# EasyEDA schematic G1000_Pan_Range.json
TITLE: Sheet_1; REV: 1.0; Date: 2024-03-31; Sheet: 1/1; Drawn By: gagagu1; Company: Your Company
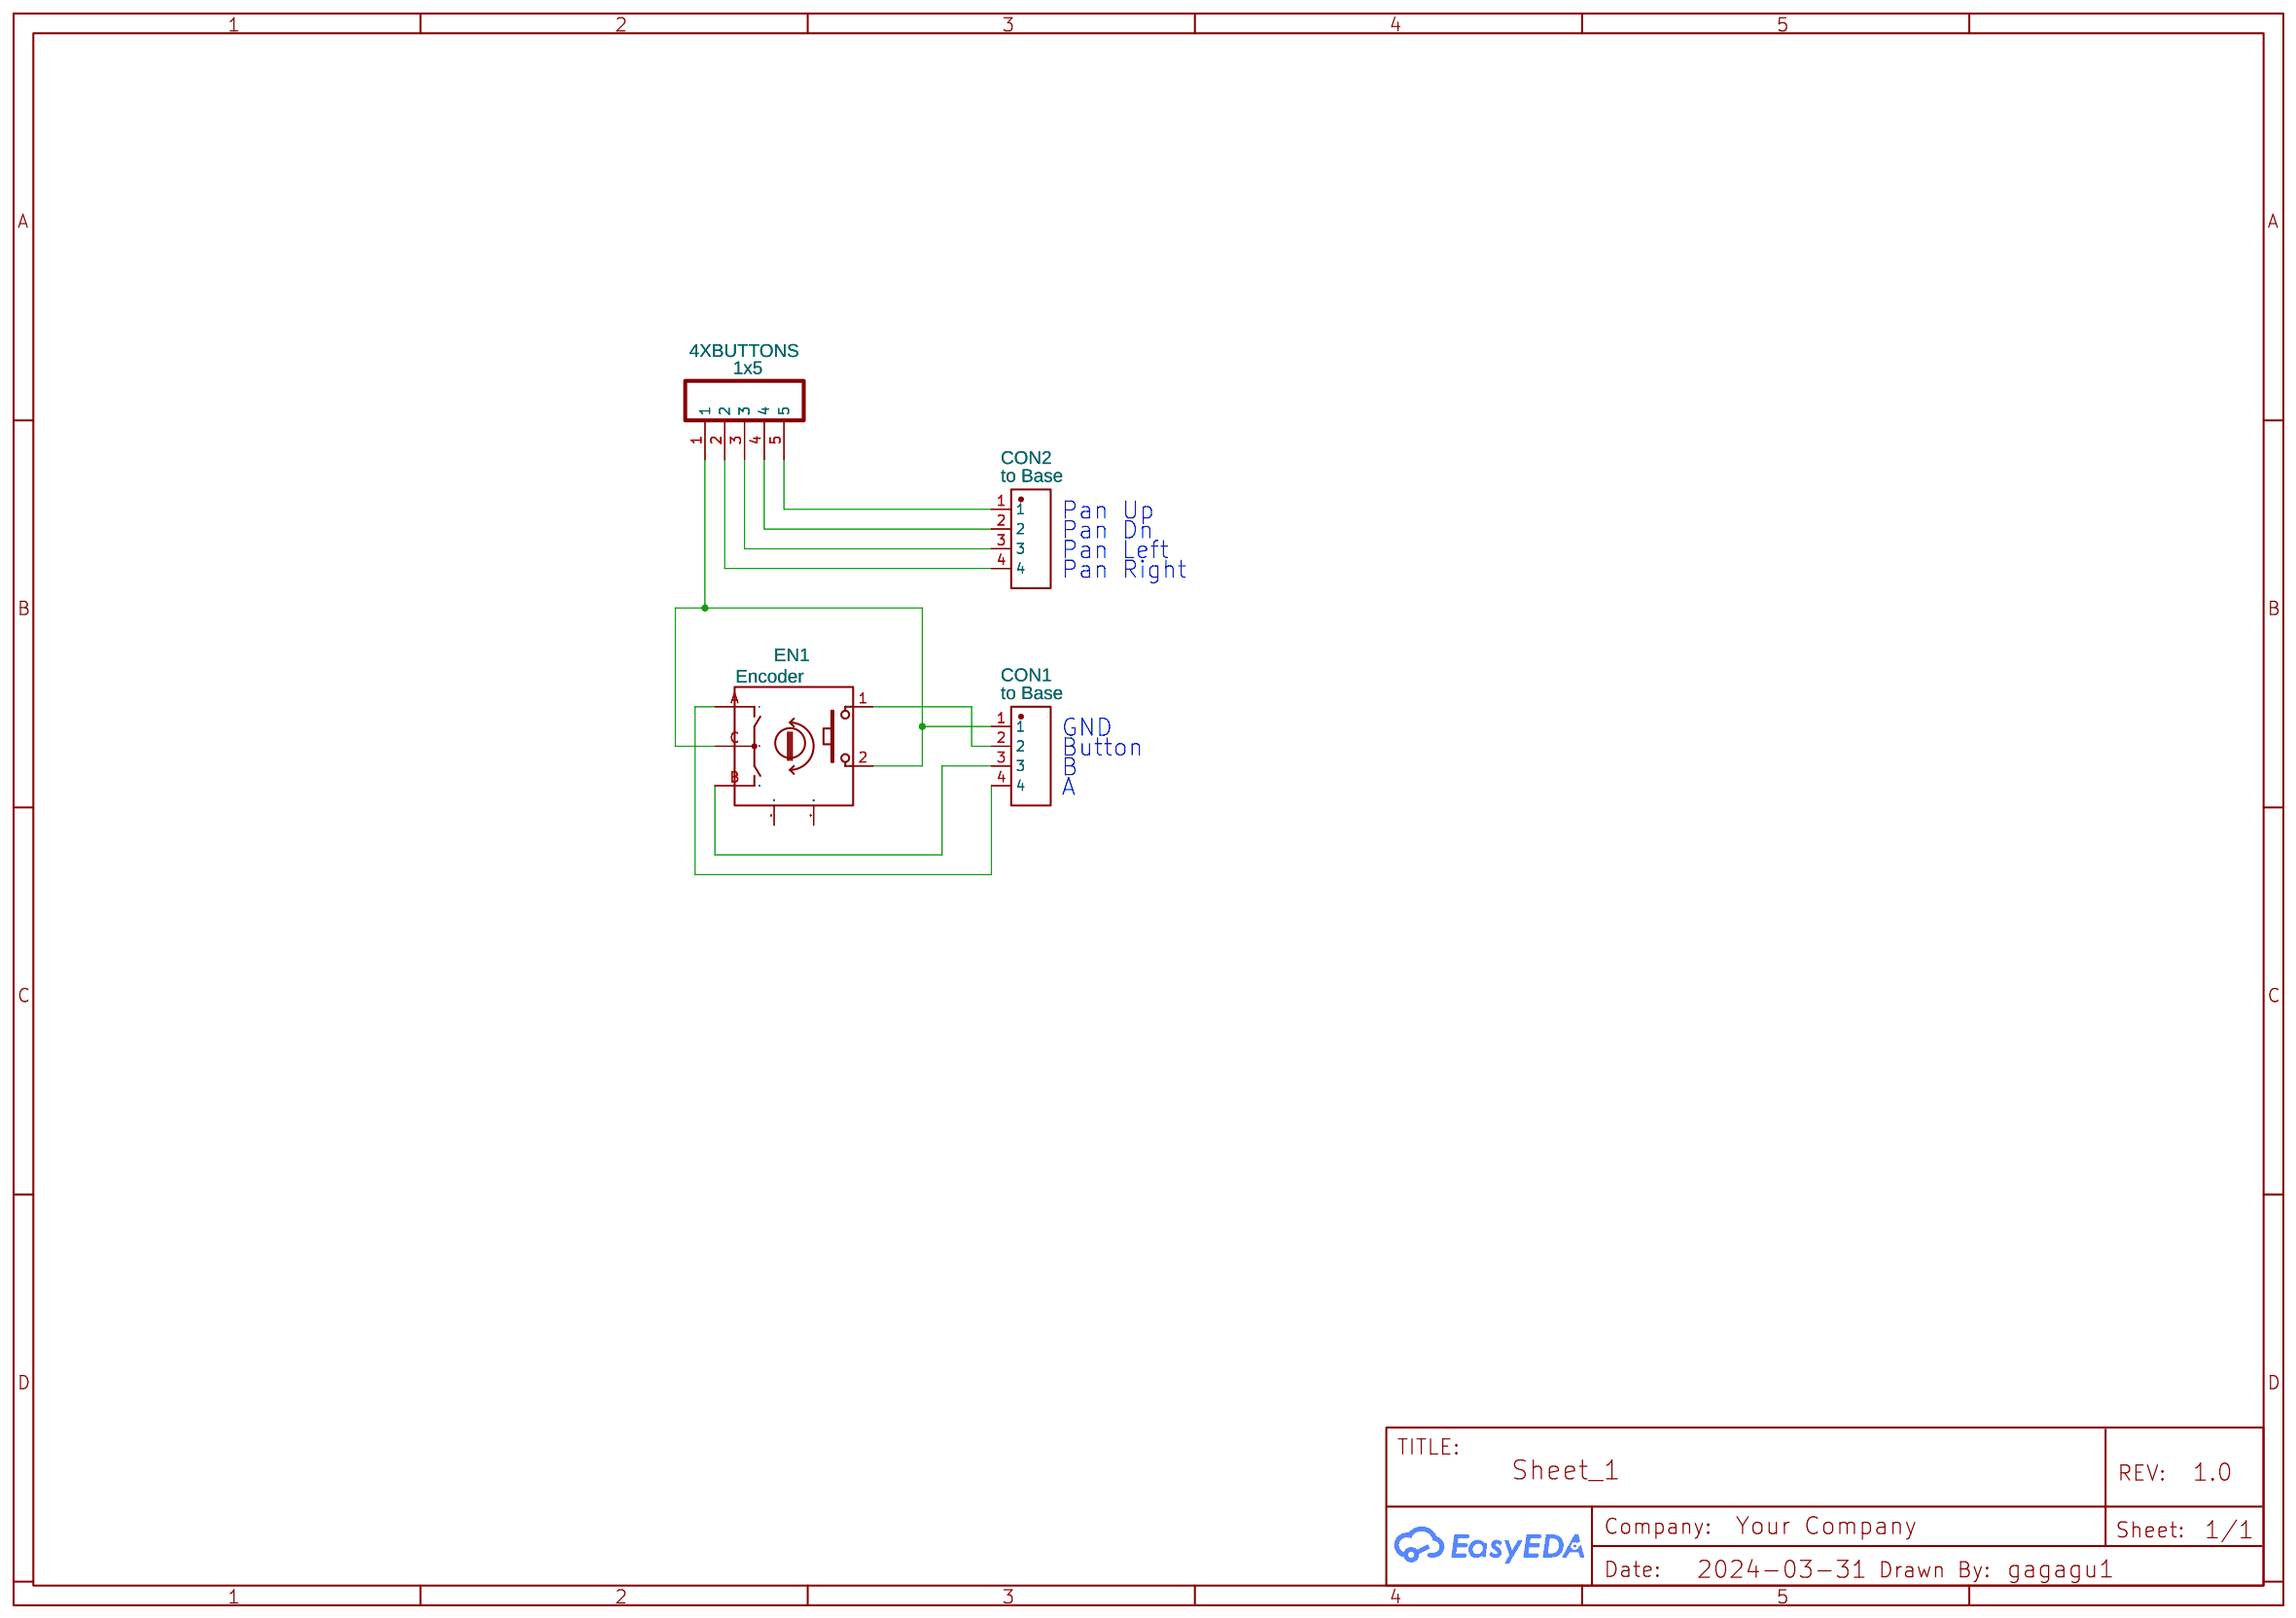
[diagram p0: schematic sheet]

## Parts
4XBUTTONS  1x5  [1X5PIN]
CON1  to Base  [ARUN-CONN-TH_XH-4A-1]
CON2  to Base  [ARUN-CONN-TH_XH-4A-1]
EN1  Encoder  [BOURNS_PEC11R-4XXXF-SXXXX]

## Library data of the parts
4XBUTTONS = 1x5: Contributor: cmacarthur
CON1 CON2 = ARUN-CONN-TH_XH-4A: Supplier: LCSC; Supplier Part: C192885; Manufacturer: BOOMELE(博穆精密); Manufacturer Part: XH-4A绿色; JLCPCB Part Class: Extended Part; Contributor: LCSC
EN1 = PEC11R-4015F-S0024: Supplier: LCSC; Supplier Part: C143789; Manufacturer: BOURNS; Contributor: Yarik_UA

## Nets
Net-(4XBUTTONS-1): 4XBUTTONS.1 CON1.1 EN1.2 EN1.C
Net-(4XBUTTONS-2): 4XBUTTONS.2 CON2.4
Net-(4XBUTTONS-3): 4XBUTTONS.3 CON2.3
Net-(4XBUTTONS-4): 4XBUTTONS.4 CON2.2
Net-(4XBUTTONS-5): 4XBUTTONS.5 CON2.1
Net-(CON1-2): CON1.2 EN1.1
Net-(CON1-3): CON1.3 EN1.B
Net-(CON1-4): CON1.4 EN1.A

Not connected (* = marked no-connect by the designer): EN1 MT1 MT2

## Notes on the sheet
- Pan Up
- Pan Dn
- Pan Left
- Pan Right
- GND
- Button
- B
- A
